# Altium project TC_TP2_EJ6.PrjPcb
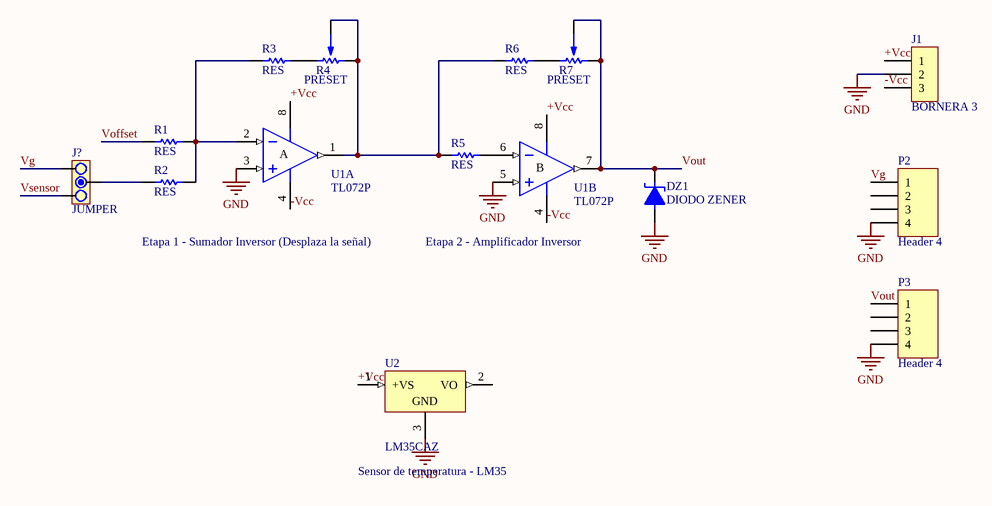
[diagram p0: TC_TP2_EJ6.SchDoc]
1 sheet, 14 parts. Net scope: global (net labels, ports and power ports of the same name join across sheets).

## Sheet TC_TP2_EJ6.SchDoc
size A4

### Parts
DZ1  DIODO ZENER  [DO41]
J1  BORNERA 3  [BORNERA3]
J?  JUMPER  [JUMPER3]
P2  Header 4  [HDR1X4]
P3  Header 4  [HDR1X4]
R1  RES  [RES400]
R2  RES  [RES400]
R3  RES  [RES400]
R4  PRESET  [PRESET V]
R5  RES  [RES400]
R6  RES  [RES400]
R7  PRESET  [PRESET V]
U1  TL072P  [P008]  (parts A,B of 2)
U2  LM35CAZ  [Z03A]

### Nets
GND: DZ1.1 J1.2 P2.4 P3.4 U1.3(IN+) U1.5(IN+) U2.3(GND)
+Vcc: J1.1 U1.8(V+) U2.1(+VS)
-Vcc: J1.3 U1.4(V-)
Vg: J?.3 P2.1
Voffset: R1.1
Vout: DZ1.2 P3.1 R7.2 R7.3 U1.7(OUT)
Vsensor: J?.1
NetJ?_2: J?.2 R2.1
NetR1_2: R1.2 R2.2 R3.1 U1.2(IN-)
NetR3_2: R3.2 R4.1
NetR4_2: R4.2 R4.3 R5.1 R6.1 U1.1(OUT)
NetR5_2: R5.2 U1.6(IN-)
NetR6_2: R6.2 R7.1

Not connected (* = marked no-connect by the designer): P2 2 3; P3 2 3; U2 2(VO)

### Notes on the sheet
- Etapa 1 - Sumador Inversor (Desplaza la señal)
- Etapa 2 - Amplificador Inversor
- Sensor de temperatura - LM35
- (in symbol TL072P, part A) A
- (in symbol TL072P, part B) B

### Library data of the parts
J? = JUMPER3
P2 P3 = Header 4: Header, 4-Pin; LatestRevisionDate: 17-Jul-2002; LatestRevisionNote: Re-released for DXP Platform.; Publisher: Altium Limited
U1 = TL072P: Low-Noise JFET-Input Operational Amplifier; Published: 16-Jan-2001; LatestRevisionDate: 04-Mar-2005; LatestRevisionNote: Stylized 3D Model Added.; DatasheetVersion: Aug-1996; PackageVersion: Jun-1999; PackageReference: P008; Publisher: Altium Limited; PackageDescription: DIP; 8 Leads; Row Spacing 7.62 mm; Pitch 2.54 mm; Code_JEDEC: MO-001-AN; ComponentLink1Description: Manufacturer Link; ComponentLink1URL: http://www.ti.com/; ComponentLink2Description: Datasheet; ComponentLink2URL: http://www-s.ti.com/sc/ds/tl072.pdf
U2 = LM35CAZ: Precision Centigrade Temperature Sensor, 3-pin TO-92; Manufacturer: National Semiconductor; PackageTopMarking: NSXYTT*LM35*CAZ; PowerWise: N; CompType: Temp Sensor IC; Published: 4-Dec-2008; LatestRevisionDate: 15-Jul-2009; LatestRevisionNote: Sch pins 1 & 3 reversed.; DatasheetVersion: Nov-2000; PackageVersion: revG, Sep-2000; PackageReference: Z03A; Publisher: Altium Limited; PackageDescription: TO-92, Molded, 3 Lead; Supplier 1: Farnell; Supplier Part Number 1: 9494529; PartNumber: LM35CAZ; RoHS: N; PinCount: 3; Code_JEDEC: TO-226-AA; ComponentLink1Description: LM35 Datasheet; ComponentLink1URL: http://www.national.com/ds/LM/LM35.pdf; ComponentLink2Description: LM35 Web Page; ComponentLink2URL: http://www.national.com/pf/LM/LM35.html; ComponentLink3Description: Z03A Package Page; ComponentLink3URL: http://www.national.com/packaging/folders/z03a.html